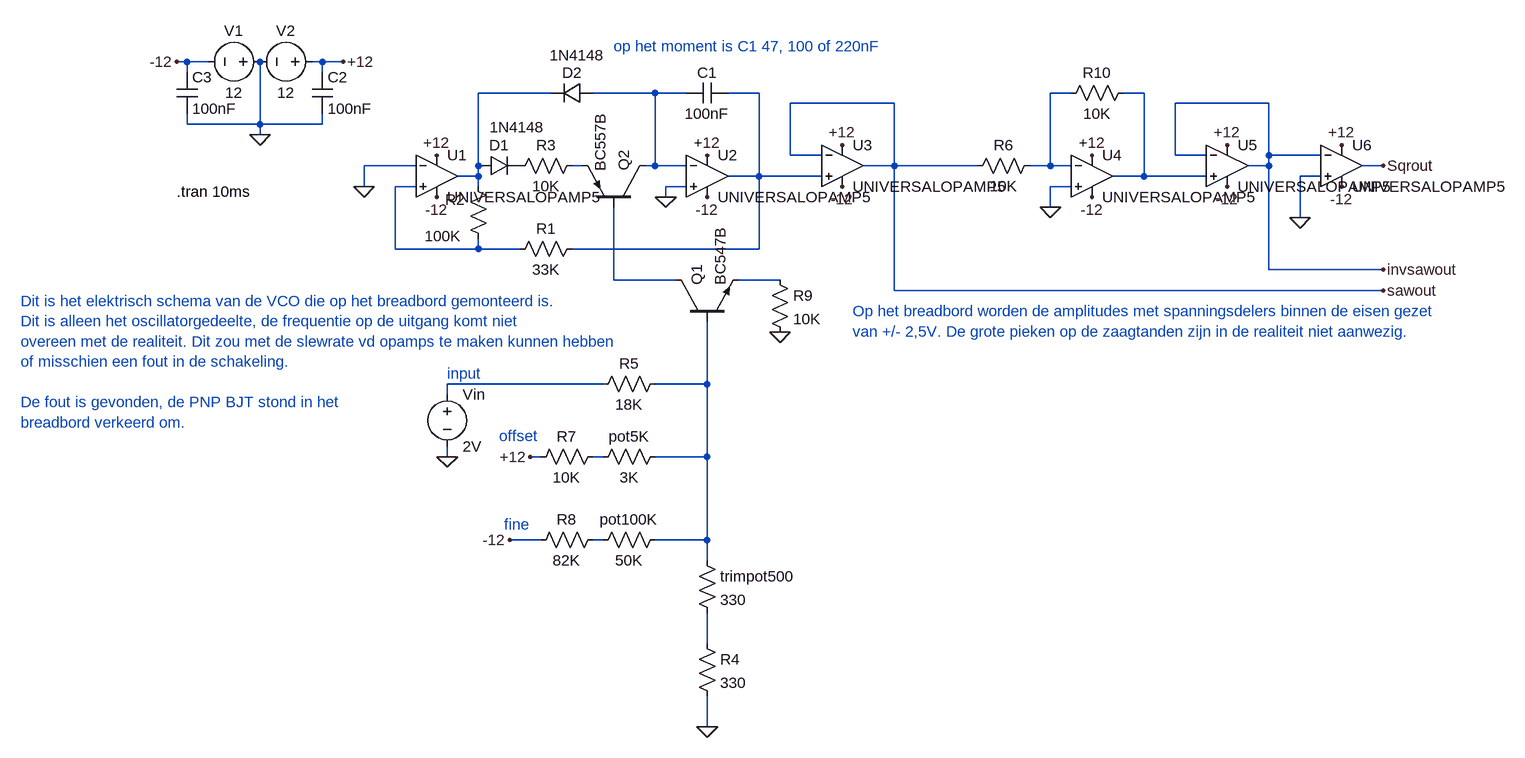
[diagram p0: schematic VCO sim Thijn Berkhoff.asc]
VCO sim Thijn Berkhoff.asc, the LTspice schematic file:
Version 4
SHEET 1 1912 1160
WIRE -272 -16 -288 -16
WIRE -240 -16 -272 -16
WIRE -64 -16 -80 -16
WIRE -32 -16 -64 -16
WIRE -272 0 -272 -16
WIRE -64 0 -64 -16
WIRE 288 32 176 32
WIRE 448 32 352 32
WIRE 496 32 448 32
WIRE 608 32 560 32
WIRE 1088 32 1056 32
WIRE 1200 32 1168 32
WIRE 816 48 656 48
WIRE 1392 48 1248 48
WIRE -272 80 -272 64
WIRE -160 80 -160 -16
WIRE -160 80 -272 80
WIRE -64 80 -64 64
WIRE -64 80 -160 80
WIRE -160 96 -160 80
WIRE 656 128 656 48
WIRE 704 128 656 128
WIRE 1248 128 1248 48
WIRE 1296 128 1248 128
WIRE 1392 128 1392 48
WIRE 1472 128 1392 128
WIRE 80 144 0 144
WIRE 176 144 176 32
WIRE 336 144 320 144
WIRE 448 144 448 32
WIRE 448 144 432 144
WIRE 496 144 448 144
WIRE 816 144 816 48
WIRE 816 144 768 144
WIRE 944 144 816 144
WIRE 1056 144 1056 32
WIRE 1056 144 1024 144
WIRE 1088 144 1056 144
WIRE 1392 144 1392 128
WIRE 1392 144 1360 144
WIRE 1568 144 1536 144
WIRE 176 160 176 144
WIRE 176 160 144 160
WIRE 608 160 608 32
WIRE 608 160 560 160
WIRE 704 160 608 160
WIRE 1200 160 1200 32
WIRE 1200 160 1152 160
WIRE 1296 160 1200 160
WIRE 1472 160 1440 160
WIRE 0 176 0 144
WIRE 80 176 48 176
WIRE 176 176 176 160
WIRE 496 176 464 176
WIRE 1088 176 1056 176
WIRE 464 192 464 176
WIRE 1056 208 1056 176
WIRE 1440 224 1440 160
WIRE 48 272 48 176
WIRE 176 272 176 256
WIRE 176 272 48 272
WIRE 240 272 176 272
WIRE 608 272 608 160
WIRE 608 272 320 272
WIRE 1392 304 1392 144
WIRE 1568 304 1392 304
WIRE 384 320 384 208
WIRE 480 320 384 320
WIRE 640 320 576 320
WIRE 816 336 816 144
WIRE 1568 336 816 336
WIRE 368 480 128 480
WIRE 528 480 528 384
WIRE 528 480 448 480
WIRE 128 496 128 480
WIRE 128 592 128 576
WIRE 272 592 256 592
WIRE 368 592 352 592
WIRE 528 592 528 480
WIRE 528 592 448 592
WIRE 272 720 224 720
WIRE 368 720 352 720
WIRE 528 720 528 592
WIRE 528 720 448 720
WIRE 528 752 528 720
WIRE 528 880 528 832
WIRE 528 1008 528 960
FLAG 0 176 0
FLAG 464 192 0
FLAG 528 192 -12
FLAG 112 192 -12
FLAG 112 128 +12
FLAG 528 128 +12
FLAG -32 -16 +12
FLAG -288 -16 -12
FLAG -160 96 0
FLAG 528 1008 0
FLAG 256 592 +12
FLAG 128 592 0
FLAG 640 400 0
FLAG 736 176 -12
FLAG 736 112 +12
FLAG 224 720 -12
FLAG 1056 208 0
FLAG 1120 128 +12
FLAG 1120 192 -12
FLAG 1328 112 +12
FLAG 1328 176 -12
FLAG 1504 112 +12
FLAG 1504 176 -12
FLAG 1440 224 0
FLAG 1568 144 Sqrout
FLAG 1568 304 invsawout
FLAG 1568 336 sawout
SYMBOL OpAmps\\UniversalOpAmp5 112 160 R0
SYMATTR InstName U1
SYMBOL OpAmps\\UniversalOpAmp5 528 160 R0
SYMATTR InstName U2
SYMBOL res 336 256 R90
WINDOW 0 0 56 VBottom 2
WINDOW 3 32 56 VTop 2
SYMATTR InstName R1
SYMATTR Value 33K
SYMBOL res 192 272 R180
WINDOW 0 36 76 Left 2
WINDOW 3 42 20 Left 2
SYMATTR InstName R2
SYMATTR Value 100K
SYMBOL cap 560 16 R90
WINDOW 0 0 32 VBottom 2
WINDOW 3 32 32 VTop 2
SYMATTR InstName C1
SYMATTR Value 100nF
SYMBOL diode 176 160 R270
WINDOW 0 32 32 VTop 2
WINDOW 3 202 152 VBottom 2
SYMATTR InstName D1
SYMATTR Value 1N4148
SYMBOL res 336 128 R90
WINDOW 0 0 56 VBottom 2
WINDOW 3 32 56 VTop 2
SYMATTR InstName R3
SYMATTR Value 10K
SYMBOL diode 352 16 R90
WINDOW 0 0 32 VBottom 2
WINDOW 3 53 116 VTop 2
SYMATTR InstName D2
SYMATTR Value 1N4148
SYMBOL voltage -144 -16 R90
WINDOW 0 -32 56 VBottom 2
WINDOW 3 32 56 VTop 2
WINDOW 123 0 0 Left 0
WINDOW 39 0 0 Left 0
SYMATTR InstName V1
SYMATTR Value 12
SYMBOL voltage -64 -16 R90
WINDOW 0 -32 56 VBottom 2
WINDOW 3 32 56 VTop 2
WINDOW 123 0 0 Left 0
WINDOW 39 0 0 Left 0
SYMATTR InstName V2
SYMATTR Value 12
SYMBOL cap -80 0 R0
SYMATTR InstName C2
SYMATTR Value 100nF
SYMBOL cap -288 0 R0
SYMATTR InstName C3
SYMATTR Value 100nF
SYMBOL npn 480 384 R270
SYMATTR InstName Q1
SYMATTR Value BC547B
SYMBOL pnp 432 208 M270
SYMATTR InstName Q2
SYMATTR Value BC557B
SYMBOL res 464 576 R90
WINDOW 0 0 56 VBottom 2
WINDOW 3 32 56 VTop 2
SYMATTR InstName pot5K
SYMATTR Value 3K
SYMBOL res 464 464 R90
WINDOW 0 0 56 VBottom 2
WINDOW 3 32 56 VTop 2
SYMATTR InstName R5
SYMATTR Value 18K
SYMBOL res 512 736 R0
SYMATTR InstName trimpot500
SYMATTR Value 330
SYMBOL voltage 128 480 R0
WINDOW 123 0 0 Left 0
WINDOW 39 0 0 Left 0
SYMATTR InstName Vin
SYMATTR Value 2V
SYMBOL res 624 304 R0
SYMATTR InstName R9
SYMATTR Value 10K
SYMBOL OpAmps\\UniversalOpAmp5 736 144 R0
SYMATTR InstName U3
SYMBOL res 368 576 R90
WINDOW 0 0 56 VBottom 2
WINDOW 3 32 56 VTop 2
SYMATTR InstName R7
SYMATTR Value 10K
SYMBOL res 512 864 R0
SYMATTR InstName R4
SYMATTR Value 330
SYMBOL res 368 704 R90
WINDOW 0 0 56 VBottom 2
WINDOW 3 32 56 VTop 2
SYMATTR InstName R8
SYMATTR Value 82K
SYMBOL res 464 704 R90
WINDOW 0 0 56 VBottom 2
WINDOW 3 32 56 VTop 2
SYMATTR InstName pot100K
SYMATTR Value 50K
SYMBOL OpAmps\\UniversalOpAmp5 1120 160 R0
SYMATTR InstName U4
SYMBOL res 1040 128 R90
WINDOW 0 0 56 VBottom 2
WINDOW 3 32 56 VTop 2
SYMATTR InstName R6
SYMATTR Value 10K
SYMBOL res 1184 16 R90
WINDOW 0 0 56 VBottom 2
WINDOW 3 32 56 VTop 2
SYMATTR InstName R10
SYMATTR Value 10K
SYMBOL OpAmps\\UniversalOpAmp5 1328 144 R0
SYMATTR InstName U5
SYMBOL OpAmps\\UniversalOpAmp5 1504 144 R0
SYMATTR InstName U6
TEXT -288 184 Left 2 !.tran 10ms
TEXT 384 -40 Left 2 ;op het moment is C1 47, 100 of 220nF
TEXT 208 560 Left 2 ;offset
TEXT 128 464 Left 2 ;input
TEXT 216 696 Left 2 ;fine
TEXT -528 352 Left 2 ;Dit is het elektrisch schema van de VCO die op het breadbord gemonteerd is.\nDit is alleen het oscillatorgedeelte, de frequentie op de uitgang komt niet \novereen met de realiteit. Dit zou met de slewrate vd opamps te maken kunnen hebben\nof misschien een fout in de schakeling.\n \nDe fout is gevonden, de PNP BJT stond in het \nbreadbord verkeerd om.
TEXT 752 368 Left 2 ;Op het breadbord worden de amplitudes met spanningsdelers binnen de eisen gezet\nvan +/- 2,5V. De grote pieken op de zaagtanden zijn in de realiteit niet aanwezig.

The netlist it stands for:
* VCO sim Thijn Berkhoff.asc
XU1 N007 0 +12 -12 N001 level5 Avol=1Meg GBW=10Meg Phimargin=45 SlewPos=10Meg SlewNeg=10Meg En=0 Enk=0 In=0 Ink=0 Rcm=500Meg Ccm=1p Rdiff=500k Cdiff=2p Ro=1k Vos=0 Ibp=2n Ibn=1n Iq=1m Rail=0 Ilimit=25m  ; UNIVERSALOPAMP5, pins In+ In- V+ V- OUT
XU2 0 N002 +12 -12 N003 level5 Avol=1Meg GBW=10Meg Phimargin=45 SlewPos=10Meg SlewNeg=10Meg En=0 Enk=0 In=0 Ink=0 Rcm=500Meg Ccm=1p Rdiff=500k Cdiff=2p Ro=1k Vos=0 Ibp=2n Ibn=1n Iq=1m Rail=0 Ilimit=25m  ; UNIVERSALOPAMP5, pins In+ In- V+ V- OUT
R1 N003 N007 33K
R2 N007 N001 100K
C1 N003 N002 100nF
D1 N001 P001 1N4148
R3 N006 P001 10K
D2 N002 N001 1N4148
V1 0 -12 12
V2 +12 0 12
C2 +12 0 100nF
C3 -12 0 100nF
Q1 N008 N011 N009 0 BC547B
Q2 N002 N008 N006 0 BC557B
R§pot5K N011 N012 3K
R5 N011 N010 18K
R§trimpot500 N011 N014 330
Vin N010 0 2V
R9 N009 0 10K
XU3 N003 sawout +12 -12 sawout level5 Avol=1Meg GBW=10Meg Phimargin=45 SlewPos=10Meg SlewNeg=10Meg En=0 Enk=0 In=0 Ink=0 Rcm=500Meg Ccm=1p Rdiff=500k Cdiff=2p Ro=1k Vos=0 Ibp=2n Ibn=1n Iq=1m Rail=0 Ilimit=25m  ; UNIVERSALOPAMP5, pins In+ In- V+ V- OUT
R7 N012 +12 10K
R4 N014 0 330
R8 N013 -12 82K
R§pot100K N011 N013 50K
XU4 0 N004 +12 -12 N005 level5 Avol=1Meg GBW=10Meg Phimargin=45 SlewPos=10Meg SlewNeg=10Meg En=0 Enk=0 In=0 Ink=0 Rcm=500Meg Ccm=1p Rdiff=500k Cdiff=2p Ro=1k Vos=0 Ibp=2n Ibn=1n Iq=1m Rail=0 Ilimit=25m  ; UNIVERSALOPAMP5, pins In+ In- V+ V- OUT
R6 N004 sawout 10K
R10 N005 N004 10K
XU5 N005 invsawout +12 -12 invsawout level5 Avol=1Meg GBW=10Meg Phimargin=45 SlewPos=10Meg SlewNeg=10Meg En=0 Enk=0 In=0 Ink=0 Rcm=500Meg Ccm=1p Rdiff=500k Cdiff=2p Ro=1k Vos=0 Ibp=2n Ibn=1n Iq=1m Rail=0 Ilimit=25m  ; UNIVERSALOPAMP5, pins In+ In- V+ V- OUT
XU6 0 invsawout +12 -12 Sqrout level5 Avol=1Meg GBW=10Meg Phimargin=45 SlewPos=10Meg SlewNeg=10Meg En=0 Enk=0 In=0 Ink=0 Rcm=500Meg Ccm=1p Rdiff=500k Cdiff=2p Ro=1k Vos=0 Ibp=2n Ibn=1n Iq=1m Rail=0 Ilimit=25m  ; UNIVERSALOPAMP5, pins In+ In- V+ V- OUT
.model D D
.lib standard.dio
.model NPN NPN
.model PNP PNP
.lib standard.bjt
.tran 10ms
* op het moment is C1 47, 100 of 220nF
* offset
* input
* fine
* Dit is het elektrisch schema van de VCO die op het breadbord gemonteerd is.
* Dit is alleen het oscillatorgedeelte, de frequentie op de uitgang komt niet
* overeen met de realiteit. Dit zou met de slewrate vd opamps te maken kunnen hebben
* of misschien een fout in de schakeling.
* De fout is gevonden, de PNP BJT stond in het
* breadbord verkeerd om.
* Op het breadbord worden de amplitudes met spanningsdelers binnen de eisen gezet
* van +/- 2,5V. De grote pieken op de zaagtanden zijn in de realiteit niet aanwezig.
.backanno
.end